# Altium project EV Kartz BMS.PrjPcb
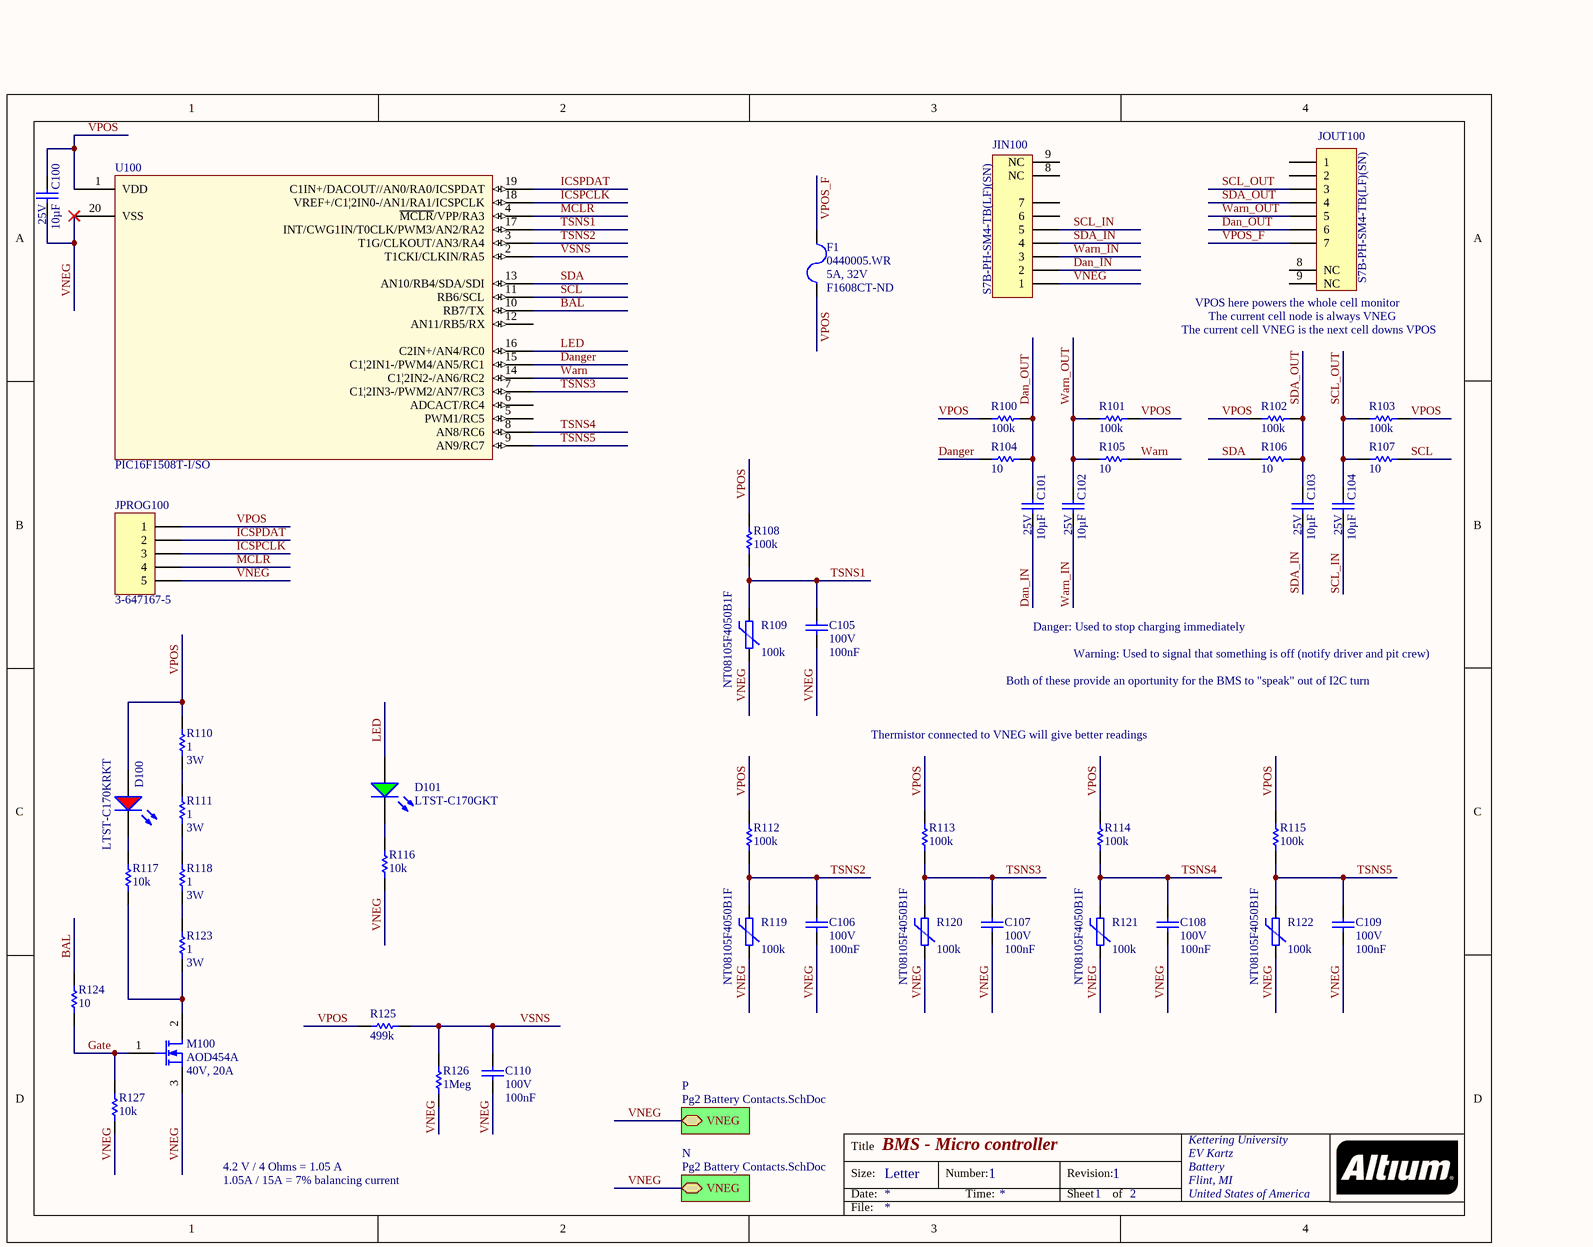
[diagram p0: Pg1 Microcontroller.SchDoc]
2 sheets, 91 parts. Net scope: hierarchical (ports join the sheet entries above them; power ports are global).
Board file: reg_PCB.PcbDoc
Sheets:
  Pg1 Microcontroller.SchDoc
    N = Pg2 Battery Contacts.SchDoc
    P = Pg2 Battery Contacts.SchDoc

## Sheet Pg1 Microcontroller.SchDoc: BMS - Micro controller
size Letter; Organization: Kettering University; Address1: EV Kartz; Address2: Battery; Address3: Flint, MI; Address4: United States of America; DocumentNumber: 1; Revision: 1; SheetNumber: 1; SheetTotal: 2

### Parts
C100  value 10µF  Rated: 25V  [CAPC3225N]  (hidden comment: C1210C106K3RACAUTO)
C101  value 10µF  Rated: 25V  [CAPC3225N]  (hidden comment: C1210C106K3RACAUTO)
C102  value 10µF  Rated: 25V  [CAPC3225N]  (hidden comment: C1210C106K3RACAUTO)
C103  value 10µF  Rated: 25V  [CAPC3225N]  (hidden comment: C1210C106K3RACAUTO)
C104  value 10µF  Rated: 25V  [CAPC3225N]  (hidden comment: C1210C106K3RACAUTO)
C105  value 100nF  Rated: 100V  [CAPC2012N]  (hidden comment: C0805C104K1RACAUTO)
C106  value 100nF  Rated: 100V  [CAPC2012N]  (hidden comment: C0805C104K1RACAUTO)
C107  value 100nF  Rated: 100V  [CAPC2012N]  (hidden comment: C0805C104K1RACAUTO)
C108  value 100nF  Rated: 100V  [CAPC2012N]  (hidden comment: C0805C104K1RACAUTO)
C109  value 100nF  Rated: 100V  [CAPC2012N]  (hidden comment: C0805C104K1RACAUTO)
C110  value 100nF  Rated: 100V  [CAPC2012N]  (hidden comment: C0805C104K1RACAUTO)
D100  LTST-C170KRKT  [DIO2012N-R]
D101  LTST-C170GKT  [DIO2012N-G]
F1  0440005.WR  Rated: 5A, 32V  Supplier Part Number 1: F1608CT-ND  [CAPC1608N]
JIN100  S7B-PH-SM4-TB(LF)(SN)  [JST-PH-S7]
JOUT100  S7B-PH-SM4-TB(LF)(SN)  [JST-PH-S7]
JPROG100  3-647167-5  [HDR1X5 SMT]
M100  AOD454A  Rated: 40V, 20A  [TO252-3N]
R100  value 100k  [RESC2012N]  (hidden comment: ERJ-6ENF1003V)
R101  value 100k  [RESC2012N]  (hidden comment: ERJ-6ENF1003V)
R102  value 100k  [RESC2012N]  (hidden comment: ERJ-6ENF1003V)
R103  value 100k  [RESC2012N]  (hidden comment: ERJ-6ENF1003V)
R104  value 10  [RESC2012N]  (hidden comment: ERJ-6ENF10R0V)
R105  value 10  [RESC2012N]  (hidden comment: ERJ-6ENF10R0V)
R106  value 10  [RESC2012N]  (hidden comment: ERJ-6ENF10R0V)
R107  value 10  [RESC2012N]  (hidden comment: ERJ-6ENF10R0V)
R108  value 100k  [RESC2012N]  (hidden comment: ERJ-6ENF1003V)
R109  NT08105F4050B1F  value 100k  [RESC2012N]
R110  value 1  Rated: 3W  [RESC6432N]  (hidden comment: 35221R0JT)
R111  value 1  Rated: 3W  [RESC6432N]  (hidden comment: 35221R0JT)
R112  value 100k  [RESC2012N]  (hidden comment: ERJ-6ENF1003V)
R113  value 100k  [RESC2012N]  (hidden comment: ERJ-6ENF1003V)
R114  value 100k  [RESC2012N]  (hidden comment: ERJ-6ENF1003V)
R115  value 100k  [RESC2012N]  (hidden comment: ERJ-6ENF1003V)
R116  value 10k  [RESC2012N]  (hidden comment: ERJ-6ENF1002V)
R117  value 10k  [RESC2012N]  (hidden comment: ERJ-6ENF1002V)
R118  value 1  Rated: 3W  [RESC6432N]  (hidden comment: 35221R0JT)
R119  NT08105F4050B1F  value 100k  [RESC2012N]
R120  NT08105F4050B1F  value 100k  [RESC2012N]
R121  NT08105F4050B1F  value 100k  [RESC2012N]
R122  NT08105F4050B1F  value 100k  [RESC2012N]
R123  value 1  Rated: 3W  [RESC6432N]  (hidden comment: 35221R0JT)
R124  value 10  [RESC2012N]  (hidden comment: ERJ-6ENF10R0V)
R125  value 499k  [RESC2012N]  (hidden comment: ERJ-6ENF4993V)
R126  value 1Meg  [RESC2012N]  (hidden comment: ERJ-6ENF1004V)
R127  value 10k  [RESC2012N]  (hidden comment: ERJ-6ENF1002V)
U100  PIC16F1508T-I/SO  [SOIC-20-300]

### Sub-sheets
N = Pg2 Battery Contacts.SchDoc: VNEG (bidir)
P = Pg2 Battery Contacts.SchDoc: VNEG (bidir)

### Nets
BAL: R124.2 U100.10(RB7/TX)
Dan_IN: C101.1 JIN100.2
Dan_OUT: C101.2 JOUT100.6 R100.1 R104.2
Danger: R104.1 U100.15(C1|2IN1-/PWM4/AN5/RC1)
Gate: M100.1(G) R124.1 R127.2
ICSPCLK: JPROG100.3 U100.18(VREF+/C1|2IN0-/AN1/RA1/ICSPCLK)
ICSPDAT: JPROG100.2 U100.19(C1IN+/DACOUT//AN0/RA0/ICSPDAT)
LED: D101.1(A) U100.16(C2IN+/AN4/RC0)
MCLR: JPROG100.4 U100.4(~{MCLR}/VPP/RA3)
SCL: R107.2 U100.11(RB6/SCL)
SCL_IN: C104.1 JIN100.5
SCL_OUT: C104.2 JOUT100.3 R103.2 R107.1
SDA: R106.1 U100.13(AN10/RB4/SDA/SDI)
SDA_IN: C103.1 JIN100.4
SDA_OUT: C103.2 JOUT100.4 R102.1 R106.2
TSNS1: C105.1 R108.1 R109.1 U100.17(INT/CWG1IN/T0CLK/PWM3/AN2/RA2)
TSNS2: C106.1 R112.1 R119.1 U100.3(T1G/CLKOUT/AN3/RA4)
TSNS3: C107.1 R113.1 R120.1 U100.7(C1|2IN3-/PWM2/AN7/RC3)
TSNS4: C108.1 R114.1 R121.1 U100.8(AN8/RC6)
TSNS5: C109.1 R115.1 R122.1 U100.9(AN9/RC7)
VNEG: C100.1 C105.2 C106.2 C107.2 C108.2 C109.2 C110.2 JIN100.1 JPROG100.5 M100.3(S) R109.2 R116.1 R119.2 R120.2 R121.2 R122.2 R126.1 R127.1 U100.20(VSS) ; sheet N/VNEG, sheet P/VNEG
VPOS: C100.2 D100.1(A) F1.2 JPROG100.1 R100.2 R101.1 R102.2 R103.1 R108.2 R110.2 R112.2 R113.2 R114.2 R115.2 R125.2 U100.1(VDD)
VPOS_F: F1.1 JOUT100.7
VSNS: C110.1 R125.1 R126.2 U100.2(T1CKI/CLKIN/RA5)
Warn: R105.2 U100.14(C1|2IN2-/AN6/RC2)
Warn_IN: C102.1 JIN100.3
Warn_OUT: C102.2 JOUT100.5 R101.2 R105.1
NetD100_2: D100.2(K) R117.2
NetD101_2: D101.2(K) R116.2
NetM100_2: M100.2(D) R117.1 R123.1
NetR110_1: R110.1 R111.2
NetR111_1: R111.1 R118.2
NetR118_1: R118.1 R123.2

Not connected (* = marked no-connect by the designer): JIN100 6 7 8(NC) 9(NC); JOUT100 1 2 8(NC) 9(NC); U100 5(PWM1/RC5) 6(ADCACT/RC4) 12(AN11/RB5/RX)

### Notes on the sheet
- (near JOUT100) VPOS here powers the whole cell monitor
- (near JOUT100) The current cell node is always VNEG
- (near JOUT100) The current cell VNEG is the next cell downs VPOS
- Danger: Used to stop charging immediately
- Warning: Used to signal that something is off (notify driver and pit crew)
- Both of these provide an oportunity for the BMS to "speak" out of I2C turn
- Thermistor connected to VNEG will give better readings
- 4.2 V / 4 Ohms = 1.05 A
- 1.05A / 15A = 7% balancing current
- Title
- Size:
- Date:
- Letter
- Number:
- Time:
- Revision:
- Sheet
- of
- File:

### Library data of the parts
C100-C104 = C1210C106K3RACAUTO: Capacitor, Ceramic, 10µF, 25V, 0805, 10%, 125C; Supplier 1: Digi-Key; Supplier Part Number 1: 399-7046-1-ND; Category: C; Tol: 10%; Temp: 125C
C105-C110 = C0805C104K1RACAUTO: Capacitor, Ceramic, 100nF, 100V, 0805, 10%, 125C; Supplier 1: Digi-Key; Supplier Part Number 1: 399-6926-1-ND; Category: C; Tol: 10%; Temp: 125C
D100 = LTST-C170KRKT: LED, SMT 0805, Red, 2.0V, 20mA; Rated: 2.0V, 20mA, 54mcd; Supplier 1: Digi-Key; Supplier Part Number 1: 160-1415-1-ND; Category: D; Value: RED
D101 = LTST-C170GKT: LED, SMT 0805, Green, 2.1V, 10mA; Rated: 2.1V, 10mA, 6mcd; Value: GRN; Supplier 1: Digi-Key; Supplier Part Number 1: 160-1179-1-ND; Category: D
F1 = 0440005.WR: Fuse, SMT, 5A, 32VAC/VDC, 1206; Value: 12mOhm; Temp: 150C; Category: F; Supplier 1: Digi-Key
JIN100 JOUT100 = S7B-PH-SM4-TB(LF)(SN): Header, JST, 7-Pin, Right-Angle, PH, Surface Mount; Category: J; Supplier 1: Digi-Key; Supplier Part Number 1: 455-1754-1-ND
JPROG100 = Hdr 3-647167-5: Header, 1x5-Pin, SMT, 100mil Pitch; Category: J; Supplier 1: Digi-Key; Supplier Part Number 1: A144616-ND
M100 = AOD454A: MOSFET, N-Ch, 40V, 20A, 430mOhm, TO252; Value: 30mOhm @ 10V; Vgs(th): 3.0V; Category: M; Supplier 1: Digi-Key; Supplier Part Number 1: 785-1223-1-ND
R100-R103 R108 R112-R115 = ERJ-6ENF1003V: Resistor, Fixed, 100 kOhm, 0805, 1%, 1/8W; Supplier 1: Digi-Key; Supplier Part Number 1: P100KCCT-ND; Rated: 1/8W; Tol: 1%; Category: R
R104-R107 R124 = ERJ-6ENF10R0V: Resistor, Fixed, 10 Ohm, 0805, 1%, 1/8W; Supplier 1: Digi-Key; Supplier Part Number 1: P10.0CCT-ND; Rated: 1/8W; Tol: 1%; Category: R
R109 R119-R122 = NTCS0805E3103FMT: Resistor, NTC Thermistor, 100kOhm, 0805, 1%, 125C; Temp: 150C; Rated: 3570K; Tol: 1%; Category: R; Supplier 1: DigiKey; Supplier Part Number 1: 283-NT08105F4050B1FCT-ND
R110 R111 R118 R123 = 35221R0JT: Resistor, Power, 1 Ohm, 6432, 5%, 3W; Tol: 5%; Category: R; Supplier 1: Digi-Key; Supplier Part Number 1: A121177CT-ND
R116 R117 R127 = ERJ-6ENF1002V: Resistor, Fixed, 10 kOhm, 0805, 1%, 1/8W; Supplier 1: Digi-Key; Supplier Part Number 1: P10.0KCCT-ND; Rated: 1/8W; Tol: 1%; Category: R
R125 = ERJ-6ENF4993V: Resistor, Fixed, 499 kOhm, 0805, 1%, 1/8W; Supplier 1: Digi-Key; Supplier Part Number 1: P499KCCT-ND; Rated: 1/8W; Tol: 1%; Category: R
R126 = ERJ-6ENF1004V: Resistor, Fixed, 1 MOhm, 0805, 1%, 1/8W; Supplier 1: Digi-Key; Supplier Part Number 1: P1.00MCCT-ND; Rated: 1/8W; Tol: 1%; Category: R
U100 = PIC16F1508T-I/SO: MCU, 8-Bit, 5V, 32MHz, 20-Pin SOIC; Rated: 2.3V ~ 5.5V; Temp: 85C; Category: U; Value: 32MHz; Supplier 1: Digi-Key; Supplier Part Number 1: PIC16F1578-I/SS-ND

## Sheet Pg2 Battery Contacts.SchDoc: EV Kartz Main BMS
size Letter; Organization: Kettering University; Address1: EV Kartz; Address2: Battery Project; Address3: Flint, MI; Address4: United States of America; DocumentNumber: 1; Revision: 1; SheetNumber: 2; SheetTotal: 2
Used 2 times, as channels N, P. Parts and nets are listed once, with the designators drawn on the sheet.
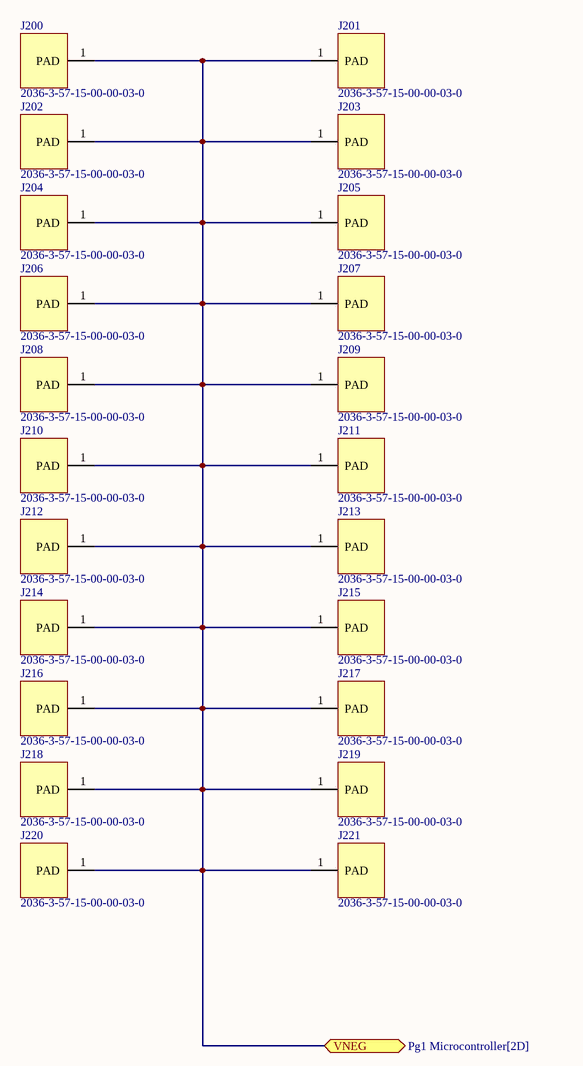
[diagram p1: Pg2 Battery Contacts.SchDoc]

### Parts
J200  2036-3-57-15-00-00-03-0  [6mm Pad]
J201  2036-3-57-15-00-00-03-0  [6mm Pad]
J202  2036-3-57-15-00-00-03-0  [6mm Pad]
J203  2036-3-57-15-00-00-03-0  [6mm Pad]
J204  2036-3-57-15-00-00-03-0  [6mm Pad]
J205  2036-3-57-15-00-00-03-0  [6mm Pad]
J206  2036-3-57-15-00-00-03-0  [6mm Pad]
J207  2036-3-57-15-00-00-03-0  [6mm Pad]
J208  2036-3-57-15-00-00-03-0  [6mm Pad]
J209  2036-3-57-15-00-00-03-0  [6mm Pad]
J210  2036-3-57-15-00-00-03-0  [6mm Pad]
J211  2036-3-57-15-00-00-03-0  [6mm Pad]
J212  2036-3-57-15-00-00-03-0  [6mm Pad]
J213  2036-3-57-15-00-00-03-0  [6mm Pad]
J214  2036-3-57-15-00-00-03-0  [6mm Pad]
J215  2036-3-57-15-00-00-03-0  [6mm Pad]
J216  2036-3-57-15-00-00-03-0  [6mm Pad]
J217  2036-3-57-15-00-00-03-0  [6mm Pad]
J218  2036-3-57-15-00-00-03-0  [6mm Pad]
J219  2036-3-57-15-00-00-03-0  [6mm Pad]
J220  2036-3-57-15-00-00-03-0  [6mm Pad]
J221  2036-3-57-15-00-00-03-0  [6mm Pad]

### Ports
VNEG (bidir, see Pg1 Microcontroller[2D])

### Nets
VNEG: J200.1(PAD) J201.1(PAD) J202.1(PAD) J203.1(PAD) J204.1(PAD) J205.1(PAD) J206.1(PAD) J207.1(PAD) J208.1(PAD) J209.1(PAD) J210.1(PAD) J211.1(PAD) J212.1(PAD) J213.1(PAD) J214.1(PAD) J215.1(PAD) J216.1(PAD) J217.1(PAD) J218.1(PAD) J219.1(PAD) J220.1(PAD) J221.1(PAD) ; port VNEG

### Channels
N: designators end in _N; ports VNEG=VNEG
P: designators end in _P; ports VNEG=VNEG

### Notes on the sheet
- Title
- Size:
- Date:
- Letter
- Number:
- Time:
- Revision:
- Sheet
- of
- File:

### Library data of the parts
J200-J221 = 2036-3-57-15-00-00-03-0: Hardware, Sprint Contact Surface; Supplier 1: Digi-Key; Supplier Part Number 1: 54-2036-3-57-15-00-00-03-0CT-ND

## Nets that join several sheets
VNEG: Pg1 Microcontroller (19 pins), N (22 pins), P (22 pins)